# EAGLE design RTC (EAGLE 6.4)
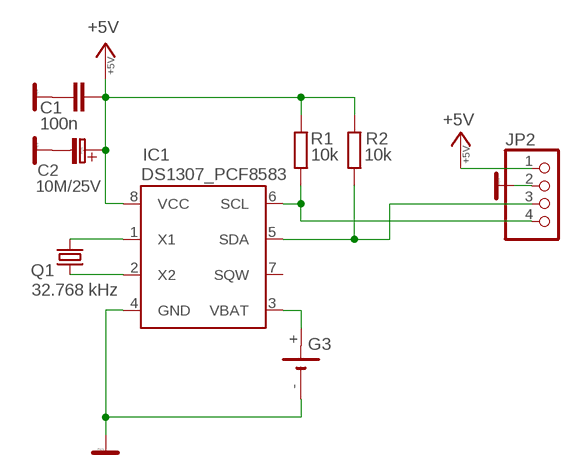
[diagram p0: schematic, sheet 1]

## Parts
C1  100n  KERAMICKYRM5  [KERAMICKY_RM5]
C2  10M/25V  [C_EL_2]
G3  VL1220  [VL1220]
IC1  DS1307_PCF8583  DS1307_PCF8583_DS1307  [DS1307_PCF8583_DIL08]
JP2  PINHD-1X4  [1X04]
Q1  32.768 kHz  GWX-26  [GWX-26]
R1  10k  R-EU_0207/10  [0207/10]
R2  10k  R-EU_0207/10  [0207/10]

## Nets
+5V: C1.P$1 C2.C+(C_EL+) IC1.8(VCC) JP2.1 R1.2 R2.2
GND: C1.P$2 C2.C-(C_EL-) G3.- IC1.4(GND) JP2.2
N$1: IC1.6(SCL) JP2.4 R1.1
N$2: IC1.5(SDA) JP2.3 R2.1
N$4: IC1.1(X1) Q1.P$2
N$5: IC1.2(X2) Q1.P$1
N$6: G3.+ IC1.3(VBAT)
Unconnected: IC1.7(SQW)

## Library data of the parts
C1 = #Kondenzatory:KERAMICKY
C2 = #PaJa_C-el_2:10M/25V
G3 = battery:VL1220
IC1 = 74141:DS1307_PCF8583_DS1307: I2C-Bus CLOCK/CALENDAR
JP2 = pinhead:PINHD-1X4: PIN HEADER
Q1 = golledge_full_v1-0:GWX-26: Crystal |Leaded| Cylindrical 2.0 x6.0 mm | Tuning Fork (Watch)| Frequency Range 32.768 kHz Low cost Range of tolerances Excellent ageing characteristics Miniature size for high density applications Large stocks of popular specifications Datasheet <http://www.golledge.com/docs/products/xtl_ld/gwx26.htm?src=eagle>; HEIGHT: 2.1
R1 R2 = #Odpory:R-EU_: RESISTOR, European symbol

## Board
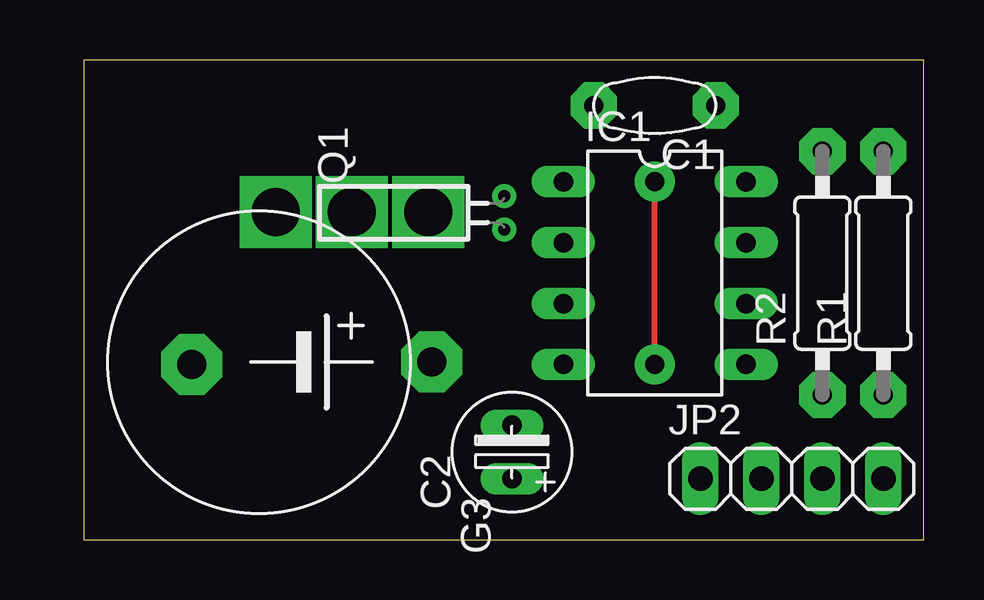
[diagram p1: board, top side]
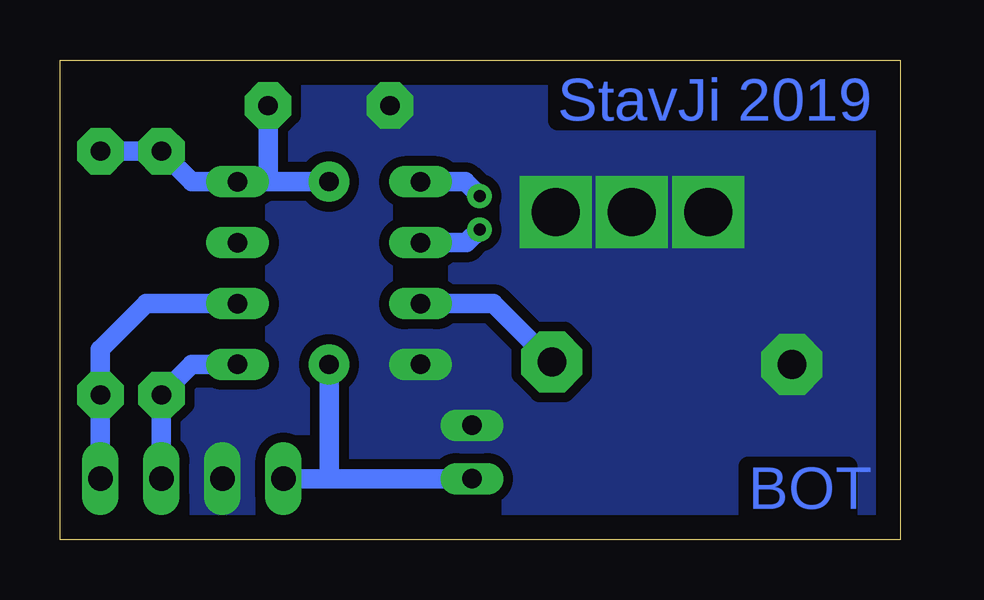
[diagram p2: board, bottom side, seen from below]

Size 35 x 20 mm. Coordinates in mm from the lower left corner, seen from the top.
Outline: 0,0 35,0 35,20 0,20 0,0
Copper layers (1*16): Top 0.035mm / dielectric 1.5mm / Bottom 0.035mm
Design rules "default": minimum track width 10mil, minimum drill 24mil, track to track 8mil, track to pad 8mil, pad to pad 8mil, via to via 8mil, smd to smd 8mil, copper to edge 40mil, drill to drill 8mil, minimum pad ring 10mil, minimum via ring 8mil, stop-mask expansion 4mil, vias tented up to drill 0mil, thermal gap 10mil

### Footprints (pad centres in the part's own frame; a part is rotated, then mirrored left to right if it is on the bottom)
KERAMICKY_RM5 = drill 0.8 pad 1.93 octagon: P$1 -2.54,0; P$2 2.54,0
C_EL_2 = drill 0.813 pad 1.27 long: C+ 0,0; C- 2.223,0
VL1220 = drill 1.2 pad 2.54 octagon: + -0.1,10; - 0,0
DS1307_PCF8583_DIL08 = drill 0.813 long: 1 -3.81,-3.81; 2 -1.27,-3.81; 3 1.27,-3.81; 4 3.81,-3.81; 5 3.81,3.81; 6 1.27,3.81; 7 -1.27,3.81; 8 -3.81,3.81
1X04 = drill 1.016 long: 1 -3.81,0; 2 -1.27,0; 3 1.27,0; 4 3.81,0
GWX-26 = drill 0.5 pad 0.9: P$1 -0.7,0; P$2 0.7,0
0207/10 = drill 0.8 pad 1.93 octagon: 1 -5.08,0; 2 5.08,0

### Placement (x,y rotation side)
C1  23.79,18.1 180 top
C2  17.84,2.54 90 top
G3  4.5,7.3 270 top
IC1  23.79,11.11 270 top
JP2  29.51,2.54 0 top
Q1  17.52,13.63 90 top
R1  33.31,11.11 90 top
R2  30.77,11.11 90 top

### Tracks (layer width: path | path; a pad name or v marks a point on that pad's centre or on a via)
+5V  (via drill 0.8 pad 1.68)
  Top 0.254: v23.79,7.3 v23.79,14.92
  Bottom 0.813: 26.33,14.92 IC1.8 29.51,14.92 R2.2 R1.2 | C1.P$1 26.33,14.92 | v23.79,14.92 26.33,14.92 | v23.79,7.3 23.79,2.54 | 23.79,2.54 JP2.1 | C2.C+ 23.79,2.54
GND  (via drill 2)
  other vias: 8,13.65 14.34,13.65 11.17,13.65
  pour Bottom (isolate 0.406, no thermals): -1.27,-3.17 63.24,-3.17 63.24,22.73 -1.27,21.73
N$1
  Bottom 0.813: IC1.6 31.41,9.84 33.31,7.94 R1.1 JP2.4
N$2
  Bottom 0.813: JP2.3 R2.1 29.51,7.3 IC1.5
N$4
  Bottom 0.813: IC1.1 18.12,14.92 Q1.P$2
N$5
  Bottom 0.813: IC1.2 18.06,12.38 Q1.P$1
N$6
  Bottom 0.813: IC1.3 16.94,9.84 G3.+

### Text on the board
Bottom: StavJi 2019 | BOT